# EAGLE schematic main (EAGLE 6.5.0)
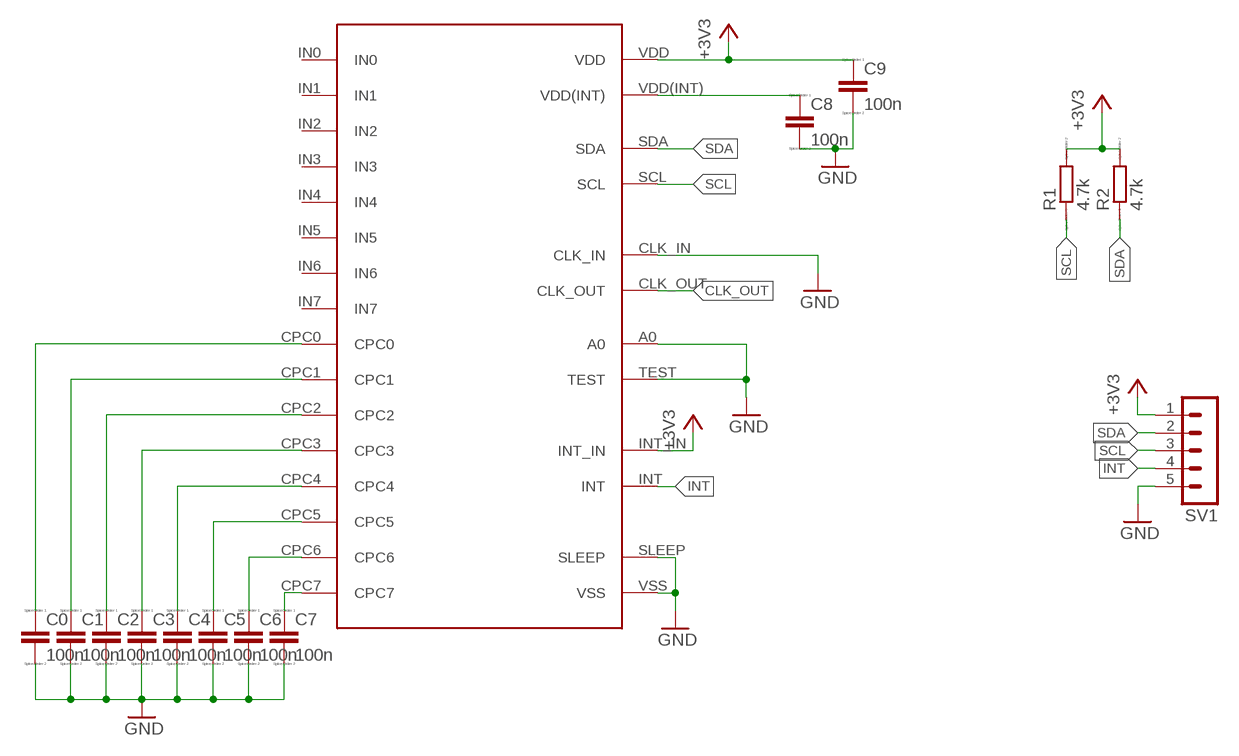
[diagram p0: schematic, sheet 1]

## Parts
C0  100n  CC0402  [C0402]
C1  100n  CC0402  [C0402]
C2  100n  CC0402  [C0402]
C3  100n  CC0402  [C0402]
C4  100n  CC0402  [C0402]
C5  100n  CC0402  [C0402]
C6  100n  CC0402  [C0402]
C7  100n  CC0402  [C0402]
C8  100n  CC0402  [C0402]
C9  100n  CC0402  [C0402]
R1  4.7k  RR0603  [R0603]
R2  4.7k  RR0603  [R0603]
SV1  MA05-1  [MA05-1]
U$1  PCA8885  [TSSOP28]

## Nets
+3V3: C9.1 R1.2 R2.2 SV1.1 U$1.INT_IN U$1.VDD
CLK_OUT: U$1.CLK_OUT
GND: C0.2 C1.2 C2.2 C3.2 C4.2 C5.2 C6.2 C7.2 C8.2 C9.2 SV1.5 U$1.A0 U$1.CLK_IN U$1.SLEEP U$1.TEST U$1.VSS
INT: SV1.4 U$1.INT
N$1: C7.1 U$1.CPC7
N$2: C6.1 U$1.CPC6
N$3: C5.1 U$1.CPC5
N$4: C4.1 U$1.CPC4
N$5: C3.1 U$1.CPC3
N$6: C2.1 U$1.CPC2
N$7: C1.1 U$1.CPC1
N$8: C0.1 U$1.CPC0
N$11: C8.1 U$1.VDD(INT)
SCL: R1.1 SV1.3 U$1.SCL
SDA: R2.1 SV1.2 U$1.SDA
Unconnected: U$1.IN0 U$1.IN1 U$1.IN2 U$1.IN3 U$1.IN4 U$1.IN5 U$1.IN6 U$1.IN7

## Library data of the parts
C0 C1-C9 = eagle-ltspice:C: CAPACITOR, European symbol; SPICEMODEL: NONE; SPICEPREFIX: C
R1 R2 = eagle-ltspice:R: RESISTOR, European symbol; SPICEMODEL: NONE; SPICEPREFIX: R
SV1 = con-lstb:MA05-1: PIN HEADER; OC_FARNELL: unknown; OC_NEWARK: unknown
U$1 = 7_segment_lib:PCA8885